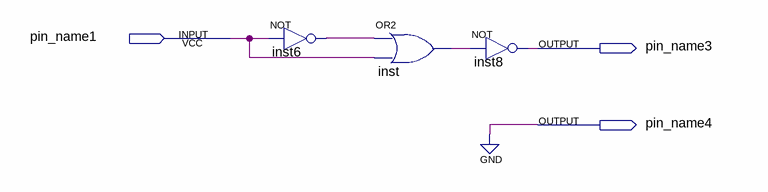
[diagram p0: schematic sheet]
// Quartus schematic exclusion_of_the_third.bdf as structural Verilog: 3 symbols, 3 pins
module exclusion_of_the_third (
  input  pin_name1,
  output pin_name3,
  output pin_name4
);

  wire inst6_out, inst_out;

  not inst6 (inst6_out, pin_name1);
  or inst (inst_out, inst6_out, pin_name1);
  not inst8 (pin_name3, inst_out);

  assign pin_name4 = 1'b0;
endmodule
